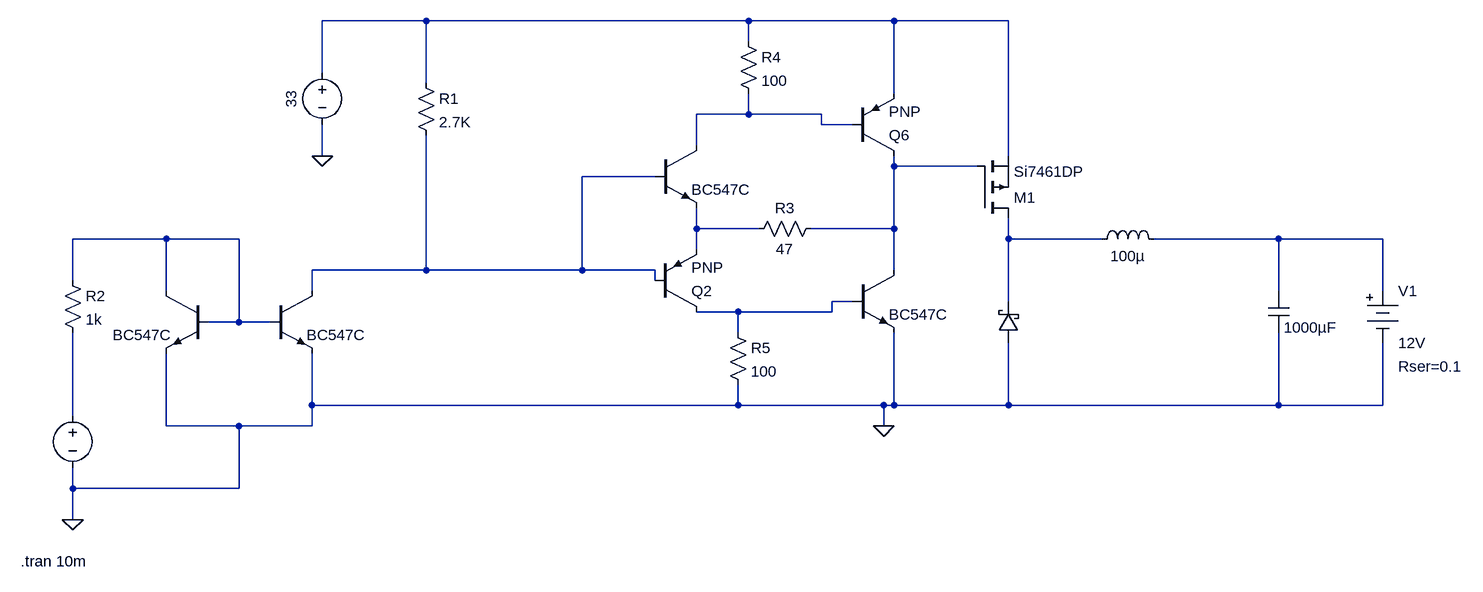
[diagram p0: schematic P Channel MOSFET and Gate Driver.asc]
P Channel MOSFET and Gate Driver.asc, the LTspice schematic file:
Version 4
SHEET 1 4320 680
WIRE -16 -304 -176 -304
WIRE 480 -304 -16 -304
WIRE 704 -304 480 -304
WIRE 880 -304 704 -304
WIRE 480 -272 480 -304
WIRE -176 -224 -176 -304
WIRE -16 -208 -16 -304
WIRE 704 -192 704 -304
WIRE 480 -160 480 -192
WIRE 480 -160 400 -160
WIRE 592 -160 480 -160
WIRE 592 -144 592 -160
WIRE 640 -144 592 -144
WIRE 400 -112 400 -160
WIRE -176 -96 -176 -144
WIRE 880 -96 880 -304
WIRE 704 -80 704 -96
WIRE 832 -80 704 -80
WIRE 336 -64 224 -64
WIRE 400 16 400 -16
WIRE 496 16 400 16
WIRE 704 16 704 -80
WIRE 704 16 576 16
WIRE -416 32 -560 32
WIRE -304 32 -416 32
WIRE 880 32 880 0
WIRE 1024 32 880 32
WIRE 1296 32 1104 32
WIRE 1456 32 1296 32
WIRE 400 48 400 16
WIRE -16 80 -16 -128
WIRE -16 80 -192 80
WIRE 224 80 224 -64
WIRE 224 80 -16 80
WIRE 336 80 224 80
WIRE 704 80 704 16
WIRE -560 96 -560 32
WIRE 336 96 336 80
WIRE -416 112 -416 32
WIRE -192 112 -192 80
WIRE 1296 112 1296 32
WIRE 1456 112 1456 32
WIRE 640 128 608 128
WIRE 880 128 880 32
WIRE 464 144 400 144
WIRE 608 144 608 128
WIRE 608 144 464 144
WIRE -304 160 -304 32
WIRE -304 160 -352 160
WIRE -256 160 -304 160
WIRE 464 176 464 144
WIRE -192 288 -192 208
WIRE 464 288 464 256
WIRE 464 288 -192 288
WIRE 688 288 464 288
WIRE 704 288 704 176
WIRE 704 288 688 288
WIRE 880 288 880 192
WIRE 880 288 704 288
WIRE 1296 288 1296 176
WIRE 1296 288 880 288
WIRE 1456 288 1456 192
WIRE 1456 288 1296 288
WIRE -560 304 -560 176
WIRE -416 320 -416 208
WIRE -304 320 -416 320
WIRE -192 320 -192 288
WIRE -192 320 -304 320
WIRE 688 320 688 288
WIRE -560 416 -560 384
WIRE -304 416 -304 320
WIRE -304 416 -560 416
WIRE -560 464 -560 416
FLAG -176 -96 0
FLAG 688 320 0
FLAG -560 464 0
DATAFLAG -560 240 ""
SYMBOL ind 1008 48 R270
WINDOW 0 32 56 Invisible 2
WINDOW 3 5 56 VBottom 2
SYMATTR InstName L1
SYMATTR Value 100µ
SYMBOL voltage -176 -240 R0
WINDOW 0 32 56 Invisible 2
WINDOW 3 -32 56 VBottom 2
WINDOW 123 0 0 Left 0
WINDOW 39 0 0 Left 0
SYMATTR InstName V2
SYMATTR Value 33
SYMBOL voltage -560 288 R0
WINDOW 0 24 16 Invisible 2
WINDOW 3 24 96 Invisible 2
WINDOW 123 0 0 Left 0
WINDOW 39 0 0 Left 0
SYMATTR InstName V4
SYMATTR Value PULSE(0 5v 1n 1n 1n 1u 3u)
SYMBOL schottky 896 192 R180
WINDOW 0 24 64 Invisible 2
WINDOW 3 24 0 Invisible 2
SYMATTR InstName D3
SYMATTR Value RBR5LAM60A
SYMATTR Description Diode
SYMATTR Type diode
SYMBOL pmos 832 0 M180
SYMATTR InstName M1
SYMATTR Value Si7461DP
SYMBOL cap 1280 112 R0
WINDOW 0 24 8 Invisible 2
SYMATTR InstName C2
SYMATTR Value 1000µF
SYMBOL Misc\\battery 1456 96 R0
WINDOW 123 0 0 Left 0
WINDOW 39 24 132 Left 2
SYMATTR SpiceLine Rser=0.1
SYMATTR InstName V1
SYMATTR Value 12V
SYMBOL npn -352 112 M0
WINDOW 0 56 32 Invisible 2
SYMATTR InstName Q4
SYMATTR Value BC547C
SYMBOL npn -256 112 R0
WINDOW 0 56 32 Invisible 2
SYMATTR InstName Q5
SYMATTR Value BC547C
SYMBOL res -576 80 R0
SYMATTR InstName R2
SYMATTR Value 1k
SYMBOL res -32 -224 R0
SYMATTR InstName R1
SYMATTR Value 2.7K
SYMBOL npn 336 -112 R0
WINDOW 0 56 32 Invisible 2
SYMATTR InstName Q1
SYMATTR Value BC547C
SYMBOL pnp 336 144 M180
SYMATTR InstName Q2
SYMBOL npn 640 80 R0
WINDOW 0 56 32 Invisible 2
SYMATTR InstName Q3
SYMATTR Value BC547C
SYMBOL pnp 640 -96 M180
SYMATTR InstName Q6
SYMBOL res 592 0 R90
WINDOW 0 0 56 VBottom 2
WINDOW 3 32 56 VTop 2
SYMATTR InstName R3
SYMATTR Value 47
SYMBOL res 464 -288 R0
SYMATTR InstName R4
SYMATTR Value 100
SYMBOL res 448 160 R0
SYMATTR InstName R5
SYMATTR Value 100
TEXT -640 528 Left 2 !.tran 10m

The netlist it stands for:
* P Channel MOSFET and Gate Driver.asc
L1 N007 N008 100µ
V2 N001 0 33
V4 N010 0 PULSE(0 5v 1n 1n 1n 1u 3u)
D3 0 N007 RBR5LAM60A
M1 N007 N003 N001 N001 Si7461DP
C2 N008 0 1000µF
V1 N008 0 12V Rser=0.1
Q4 N006 N006 0 0 BC547C
Q5 N004 N006 0 0 BC547C
R2 N006 N010 1k
R1 N001 N004 2.7K
Q1 N002 N004 N005 0 BC547C
Q2 N009 N004 N005 0 PNP
Q3 N003 N009 0 0 BC547C
Q6 N003 N002 N001 0 PNP
R3 N003 N005 47
R4 N001 N002 100
R5 N009 0 100
.model D D
.lib standard.dio
.model NPN NPN
.model PNP PNP
.lib standard.bjt
.model NMOS NMOS
.model PMOS PMOS
.lib standard.mos
.tran 10m
.backanno
.end